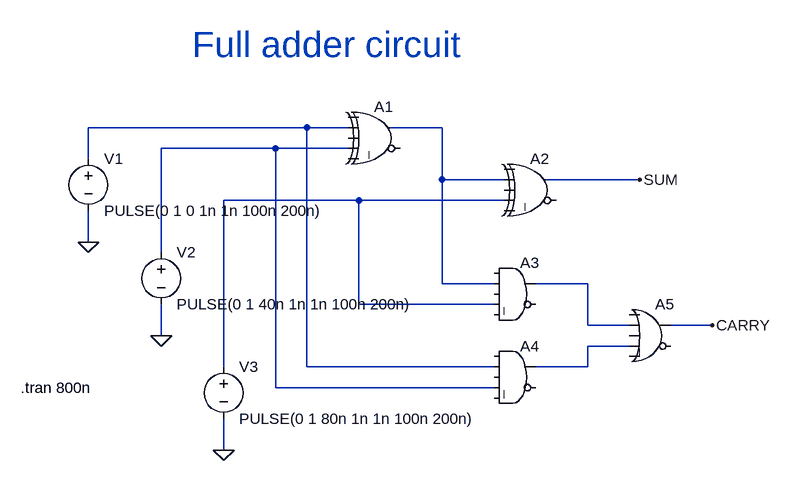
[diagram p0: schematic Full Adder circuit RKD.asc]
Full Adder circuit RKD.asc, the LTspice schematic file:
Version 4
SHEET 1 880 680
WIRE 112 64 -224 64
WIRE 176 64 112 64
WIRE 320 64 240 64
WIRE 64 96 -112 96
WIRE 176 96 64 96
WIRE -224 112 -224 64
WIRE 320 144 320 64
WIRE 416 144 320 144
WIRE 624 144 480 144
WIRE 192 176 -16 176
WIRE 416 176 192 176
WIRE -224 240 -224 192
WIRE -112 256 -112 96
WIRE 320 304 320 144
WIRE 400 304 320 304
WIRE 544 304 464 304
WIRE 192 336 192 176
WIRE 400 336 192 336
WIRE 544 368 544 304
WIRE 608 368 544 368
WIRE 736 368 672 368
WIRE -112 384 -112 336
WIRE 608 400 544 400
WIRE -16 432 -16 176
WIRE 112 432 112 64
WIRE 400 432 112 432
WIRE 544 432 544 400
WIRE 544 432 464 432
WIRE 64 464 64 96
WIRE 400 464 64 464
WIRE -16 560 -16 512
FLAG -224 240 0
FLAG -112 384 0
FLAG -16 560 0
FLAG 624 144 SUM
FLAG 736 368 CARRY
SYMBOL Digital\\xor 224 16 R0
SYMATTR InstName A1
SYMBOL Digital\\xor 464 96 R0
SYMATTR InstName A2
SYMBOL Digital\\and 432 256 R0
SYMATTR InstName A3
SYMBOL Digital\\and 432 384 R0
SYMATTR InstName A4
SYMBOL voltage -224 96 R0
WINDOW 123 0 0 Left 0
WINDOW 39 0 0 Left 0
SYMATTR InstName V1
SYMATTR Value PULSE(0 1 0 1n 1n 100n 200n)
SYMBOL voltage -112 240 R0
WINDOW 123 0 0 Left 0
WINDOW 39 0 0 Left 0
SYMATTR InstName V2
SYMATTR Value PULSE(0 1 40n 1n 1n 100n 200n)
SYMBOL voltage -16 416 R0
WINDOW 123 0 0 Left 0
WINDOW 39 0 0 Left 0
SYMATTR InstName V3
SYMATTR Value PULSE(0 1 80n 1n 1n 100n 200n)
SYMBOL Digital\\or 640 320 R0
SYMATTR InstName A5
TEXT -328 464 Left 2 !.tran 800n
TEXT -64 -64 Left 5 ;Full adder circuit

The netlist it stands for:
* Full Adder circuit RKD.asc
A1 0 N001 0 N003 0 0 N002 0 XOR
A2 0 N002 0 N004 0 0 SUM 0 XOR
A3 0 N002 0 N004 0 0 N005 0 AND
A4 0 N001 0 N003 0 0 N006 0 AND
V1 N001 0 PULSE(0 1 0 1n 1n 100n 200n)
V2 N003 0 PULSE(0 1 40n 1n 1n 100n 200n)
V3 N004 0 PULSE(0 1 80n 1n 1n 100n 200n)
A5 0 N005 0 N006 0 0 CARRY 0 OR
.tran 800n
* Full adder circuit
.backanno
.end